# Altium schematic sheet Driver_Fet.SchDoc
size A4; Organization: Altium Limited; Address1: L3, 12a Rodborough Rd; Address2: Frenchs Forest; Address3: NSW; Address4: Australia 2086
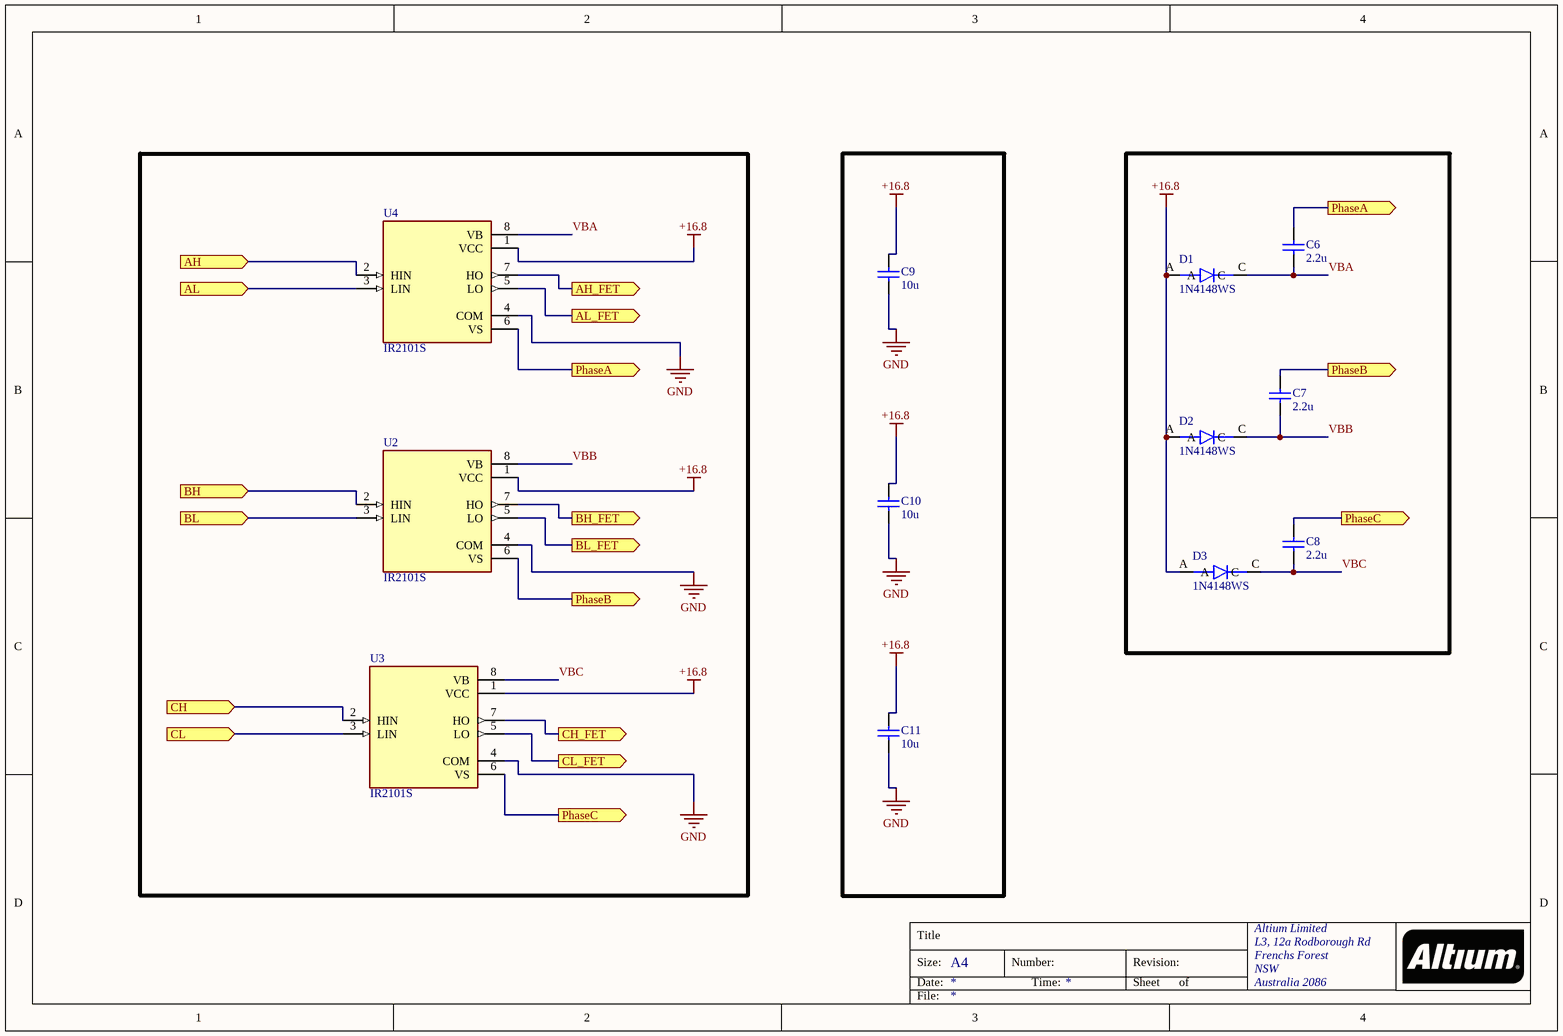
[diagram p0: Driver_Fet.SchDoc]

## Parts
C6  2.2u  [tu 0805]
C7  2.2u  [tu 0805]
C8  2.2u  [tu 0805]
C9  10u  [tu 0805]
C10  10u  [tu 0805]
C11  10u  [tu 0805]
D1  1N4148WS  [SODFL2512X100N]
D2  1N4148WS  [SODFL2512X100N]
D3  1N4148WS  [SODFL2512X100N]
U2  IR2101S  [SOIC127P600X175-8N]
U3  IR2101S  [SOIC127P600X175-8N]
U4  IR2101S  [SOIC127P600X175-8N]

## Ports
AH (in), AH_FET (out), AL (in), AL_FET (out), BH (in), BH_FET (out), BL (in), BL_FET (out), CH (in), CH_FET (out), CL (in), CL_FET (out), PhaseA (out), PhaseB (out), PhaseC (out)

## Nets
+16.8: C9.1 C10.1 C11.1 D1.A D2.A D3.A U2.1(VCC) U3.1(VCC) U4.1(VCC)
GND: C9.2 C10.2 C11.2 U2.4(COM) U3.4(COM) U4.4(COM)
AH: U4.2(HIN) ; port AH
AH_FET: U4.7(HO) ; port AH_FET
AL: U4.3(LIN) ; port AL
AL_FET: U4.5(LO) ; port AL_FET
BH: U2.2(HIN) ; port BH
BH_FET: U2.7(HO) ; port BH_FET
BL: U2.3(LIN) ; port BL
BL_FET: U2.5(LO) ; port BL_FET
CH: U3.2(HIN) ; port CH
CH_FET: U3.7(HO) ; port CH_FET
CL: U3.3(LIN) ; port CL
CL_FET: U3.5(LO) ; port CL_FET
PhaseA: C6.1 U4.6(VS) ; port PhaseA
PhaseB: C7.1 U2.6(VS) ; port PhaseB
PhaseC: C8.1 U3.6(VS) ; port PhaseC
VBA: C6.2 D1.C U4.8(VB)
VBB: C7.2 D2.C U2.8(VB)
VBC: C8.2 D3.C U3.8(VB)

## Notes on the sheet
- Title
- Size:
- Date:
- A4
- Number:
- Time:
- Revision:
- Sheet
- of
- File:

## Library data of the parts
C6-C11 = Tu 0805 106 16V 10%: Dán; Ten_Linh_Kien: Tụ 0805 106-10uF 10% 16V; So_Chan: 2; Don_Vi: Con; Ma_Hang: MH004553; Chung_Loai: Dán; Kieu_Chan: *
D1-D3 = 1N4148WS: Diode Standard 75V 300mA (DC) Surface Mount SOD-323; MF: ON Semiconductor; Purchase-URL: https://pricing.snapeda.com/search/part/1N4148WS/?ref=eda; Value: *; Package: SOD-323FL-2 ON Semiconductor; Availability: In Stock; Price: None; MP: 1N4148WS
U2-U4 = IR2101S: Half-Bridge Gate Driver IC Non-Inverting 8-SOIC; MF: Infineon Technologies; Purchase-URL: https://pricing.snapeda.com/search/part/IR2101S/?ref=eda; Package: SOIC-8 Infineon; Value: *; Check_prices: https://www.snapeda.com/parts/IR2101S/Infineon+Technologies/view-part/?ref=eda; SnapEDA_Link: https://www.snapeda.com/parts/IR2101S/Infineon+Technologies/view-part/?ref=snap; Availability: In Stock; Price: None; MP: IR2101S